# EAGLE design Controller-Power (EAGLE 7.5.0)
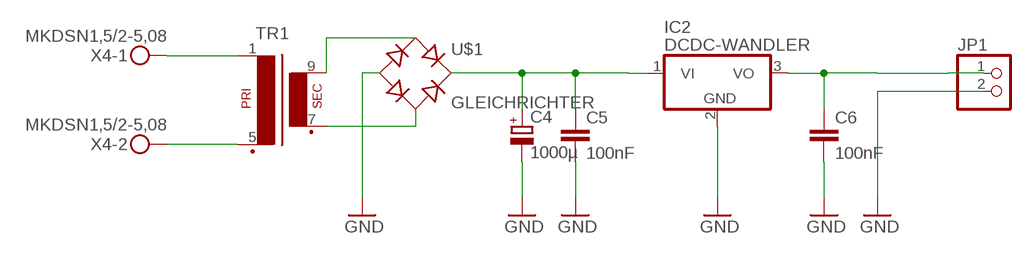
[diagram p0: schematic, sheet 1]

## Parts
C4  1000µ  CPOL-EUE3.5-8  [E3,5-8]
C5  100nF  C-EUC0805  [C0805]
C6  100nF  C-EUC0805  [C0805]
IC2  DCDC-WANDLER  [TRACOPOWER-DCDCWANDER-TSR1]
JP1  PINHD-1X2  [1X02]
TR1  EI38-1  [EI38-1]
U$1  GLEICHRICHTER  [KBPC1]
X4  MKDSN1,5/2-5,08  [MKDSN1,5/2-5,08]

## Nets
GND: C4.- C5.2 C6.2 IC2.2(GND) JP1.2 U$1.-
N$17: C4.+ C5.1 IC2.1(VI) U$1.+
N$19: TR1.1 X4.1
N$20: TR1.5(P2) X4.2
N$21: TR1.7(S3) U$1.AC2
N$22: TR1.9(S4) U$1.AC1
N$25: C6.1 IC2.3(VO) JP1.1

## Library data of the parts
C4 = rcl:CPOL-EU: POLARIZED CAPACITOR, European symbol
C5 C6 = rcl:C-EU: CAPACITOR, European symbol
IC2 = 0liver:DCDC-WANDLER
JP1 = pinhead:PINHD-1X2: PIN HEADER
TR1 = trafo:EI38-1: TRANSFORMER 1 primary winding, 1 secondary winding ERA
U$1 = Gleichrichter:GLEICHRICHTER
X4 = con-phoenix-508:MKDSN1,5/2-5,08: MKDSN 1,5/ 2-5,08 Printklemme Nennstrom: 13,5 A Nennspannung: 250 V Rastermaß: 5,08 mm Polzahl: 2 Anschlussart: Schraubanschluss Montage: Löten Anschlussrichtung Leiter/Platine: 0 ° Artikelnummer: 1729128 Source: http://eshop.phoenixcontact.com .. 1729128.pdf

## Board
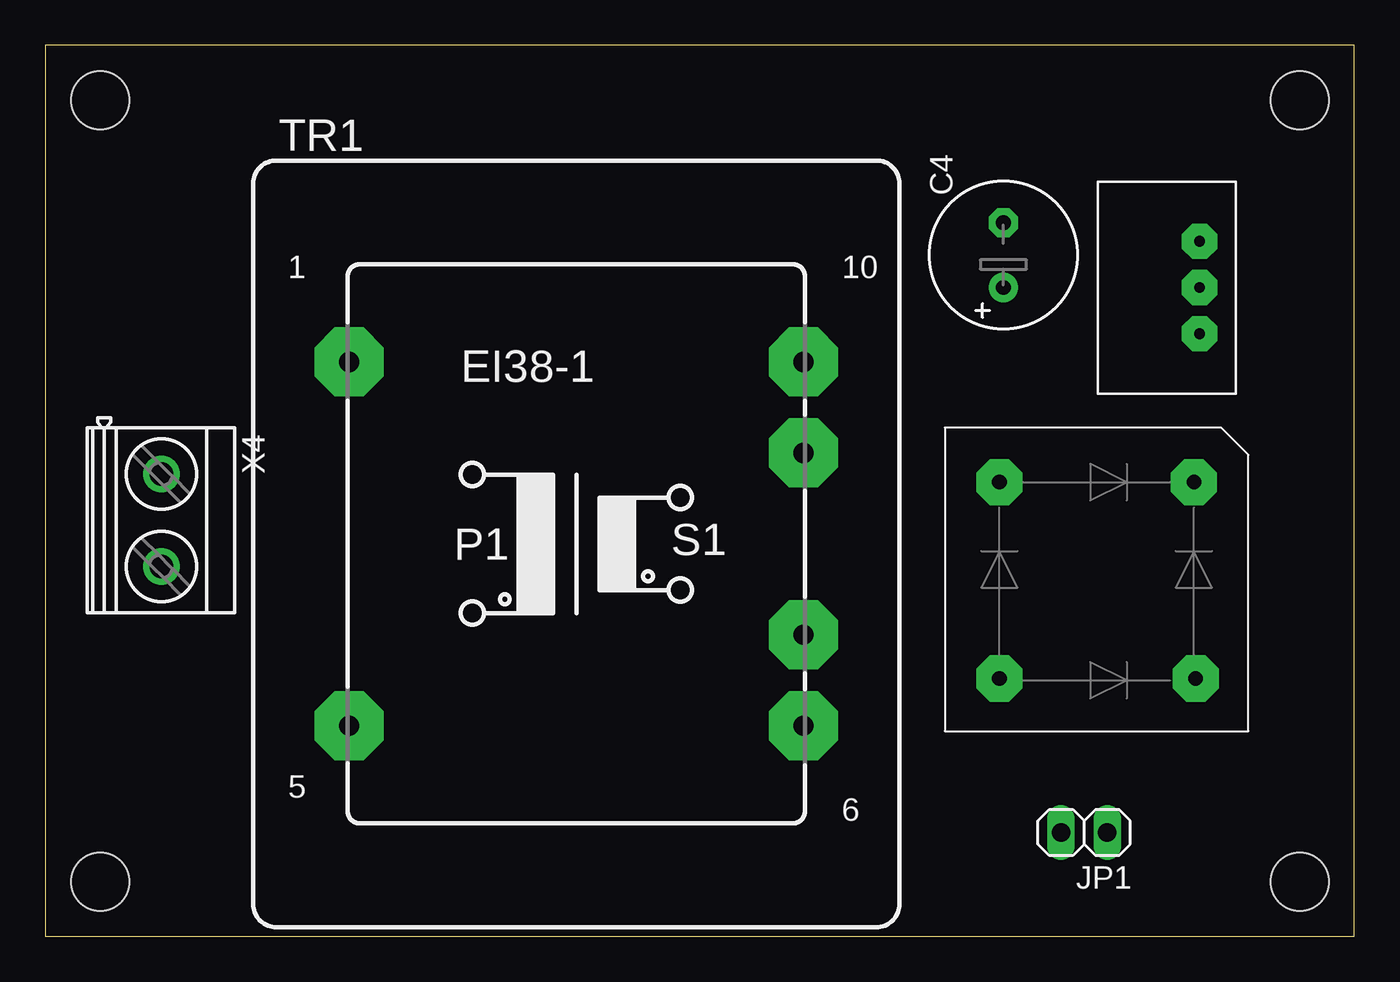
[diagram p1: board, top side]
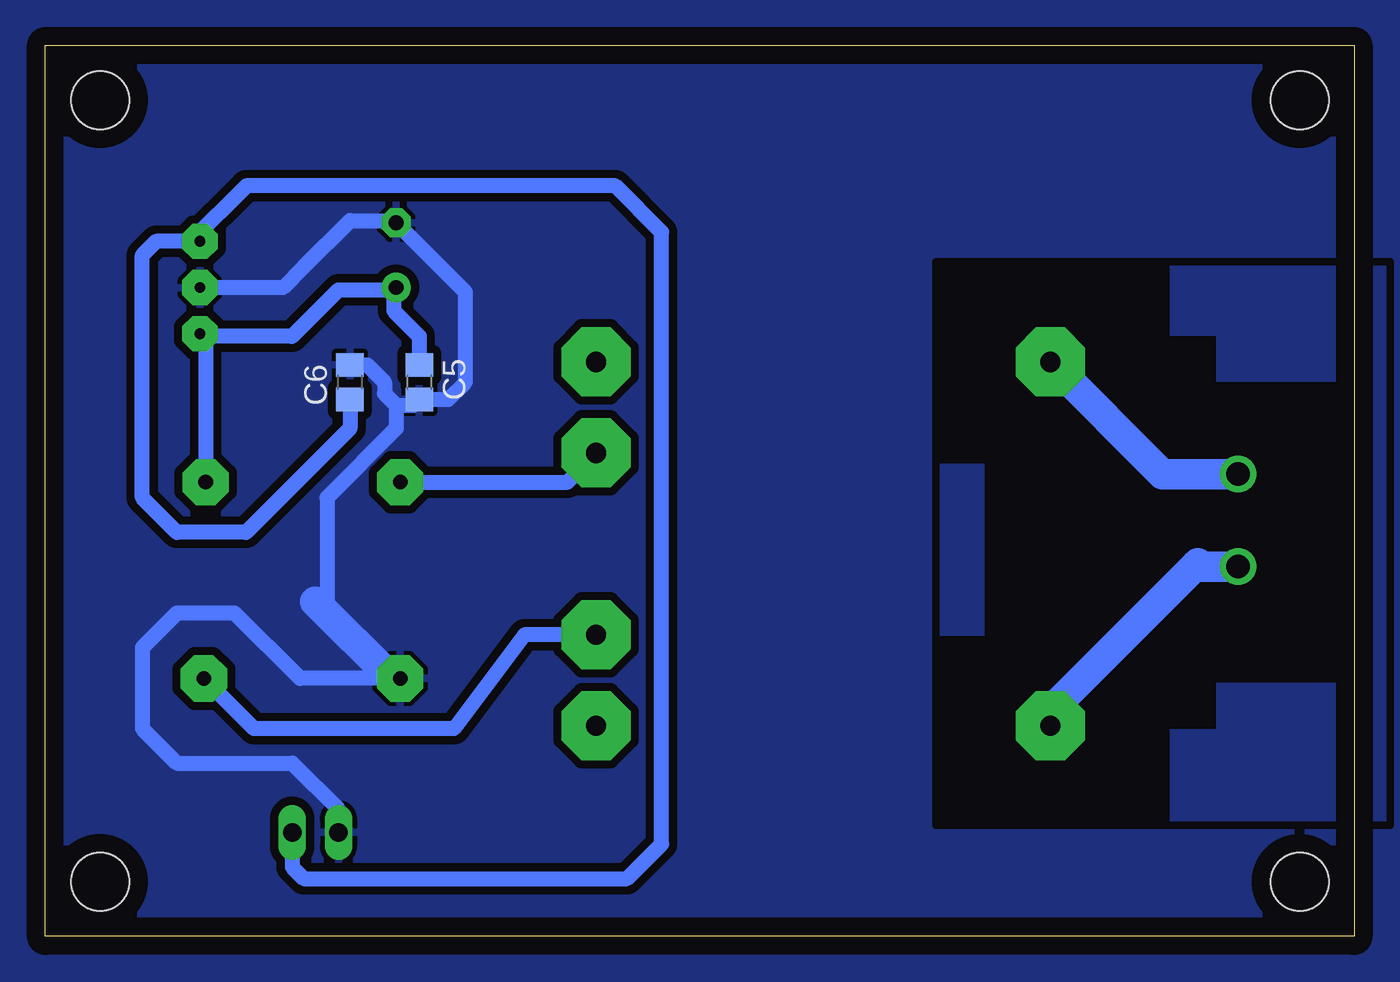
[diagram p2: board, bottom side, seen from below]

Size 72 x 49 mm. Coordinates in mm from the lower left corner, seen from the top.
Outline: 0,0 72,0 72,49 0,49 0,0
Copper layers (1*16): Top 0.035mm / dielectric 1.5mm / Bottom 0.035mm
Design rules "default *": minimum track width 10mil, minimum drill 24mil, track to track 18mil, track to pad 18mil, pad to pad 18mil, via to via 18mil, smd to smd 8mil, copper to edge 40mil, drill to drill 8mil, minimum pad ring 10mil, minimum via ring 8mil, stop-mask expansion 4mil, vias tented up to drill 0mil, thermal gap 10mil
Holes 3.2 mm at 3,3 69,3 69,46 3,46
bRestrict: area 10.2,26 to 22.9,36.8; area 10.2,6.3 to 22.9,16.5; area 0.6,14 to 15.2,30.5; area 14.6,15.9 to 20.3,26.7; area 7.6,29.2 to 11.4,33; area 7.6,11.4 to 11.4,15.2; 7 lines

### Footprints (pad centres in the part's own frame; a part is rotated, then mirrored left to right if it is on the bottom)
E3,5-8 = drill 0.813 pad 1.6: + -1.778,0 | drill 0.813 pad 1.6 octagon: - 1.778,0
C0805 = smd 1.3 x 1.5: 1 -0.95,0; 2 0.95,0
TRACOPOWER-DCDCWANDER-TSR1 = drill 0.6 pad 1.93 octagon: 1 0,0; 2 2.54,0; 3 5.08,0
1X02 = drill 1.016 long: 1 -1.27,0; 2 1.27,0
EI38-1 = drill 1.118 pad 3.81 octagon: 1 -12.497,10.008; 5 -12.497,-10.008; 6 12.497,-10.008; 7 12.497,-5.004; 9 12.497,5.004; 10 12.497,10.008
KBPC1 = drill 0.8 pad 2.54 octagon: + -5.3,5.4; - 5.5,-5.3; AC1 -5.3,-5.3; AC2 5.5,5.5
MKDSN1,5/2-5,08 = drill 1.3 pad 2: 1 -2.561,0.025; 2 2.519,0.025

### Placement (x,y rotation side)
C4  52.7,37.47 90 top
C5  51.44,30.48 270 bottom
C6  55.24,30.48 90 bottom
IC2  63.5,33.15 90 top
JP1  57.15,5.71 180 top
TR1  29.21,21.59 0 top
U$1  57.78,19.68 270 top
X4  6.35,22.86 270 top

### Tracks (layer width: path | path; a pad name or v marks a point on that pad's centre or on a via)
GND
  Bottom 0.813: 57.78,36.83 55.24,39.37 | 55.24,39.37 52.83,39.37 C4.- 48.9,35.43 48.9,30.48 49.84,29.53 C5.2 51.76,29.21 52.7,29.21 | C6.2 54.29,31.43 53.34,30.48 53.34,29.84 52.7,29.21 | 57.78,36.83 55.24,39.37 | 52.7,29.21 52.7,27.94 56.52,24.13 56.52,18.21 U$1.- 58,14.19 61.59,17.78 64.77,17.78 66.67,15.88 66.67,11.43 64.77,9.53 58.42,9.53 55.88,6.99 JP1.2 | 57.78,36.83 58.93,35.69 IC2.2
  Bottom 1.676: U$1.- 52.92,14.19 57.15,18.41
  pour Bottom: -4.17,-4.17 76.5,-4.17 76.5,49.41 -4.17,49.41
N$16
  pour Bottom: -9.71,51.67 80.05,51.67 80.05,-8.08 -9.71,-8.08
N$17
  Bottom 0.813: 52.83,35.56 55.88,35.56 58.42,33.02 58.44,33 63,33 63.15,33.15 IC2.1 63.19,32.83 U$1.+ | 52.83,35.56 C4.+ | 52.83,35.56 52.83,34.42 51.44,33.02 C5.1
  Bottom 1.016: 62.87,25.3 U$1.+
N$19
  Bottom 1.676: X4.1 10.54,25.42 TR1.1
N$20
  Bottom 1.676: X4.2 8.77,20.34 8.61,20.51 17.14,11.97 17.14,11.43 | 17.14,11.43 16.51,10.79 17.14,11.43 | 17.14,11.43 16.87,11.43 TR1.5
N$21
  Bottom 0.813: TR1.7 45.64,16.59 49.53,11.43 60.53,11.43 U$1.AC2
N$22
  Bottom 0.813: U$1.AC1 43.27,24.98 TR1.9
N$25
  Bottom 0.813: C6.1 55.24,27.94 60.96,22.23 64.77,22.23 66.67,24.13 66.67,37.47 65.91,38.23 64,38.23 | JP1.1 58.42,3.81 57.78,3.17 40.01,3.17 38.1,5.08 38.1,38.73 40.64,41.27 60.96,41.27 64,38.23 | IC2.3 64,38.23

### Text on the board
Bottom: Spannungsversorgung Controller v1.0